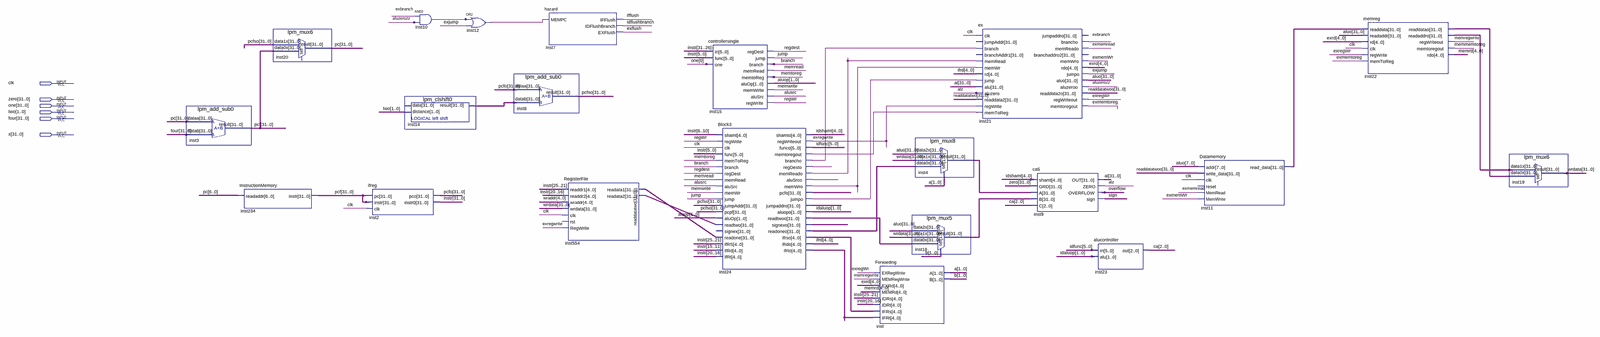
[diagram p0: schematic sheet, whole]
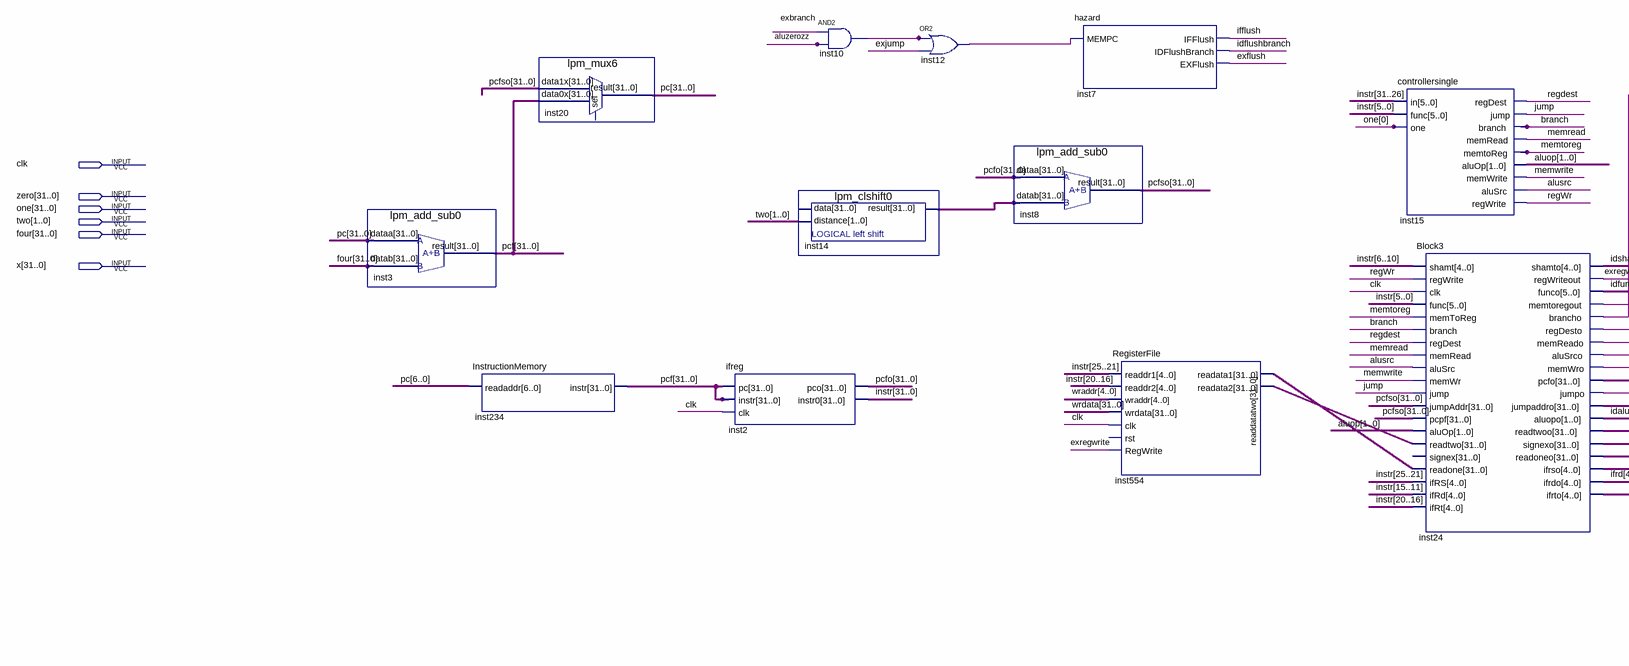
[diagram p1: schematic sheet, left part]
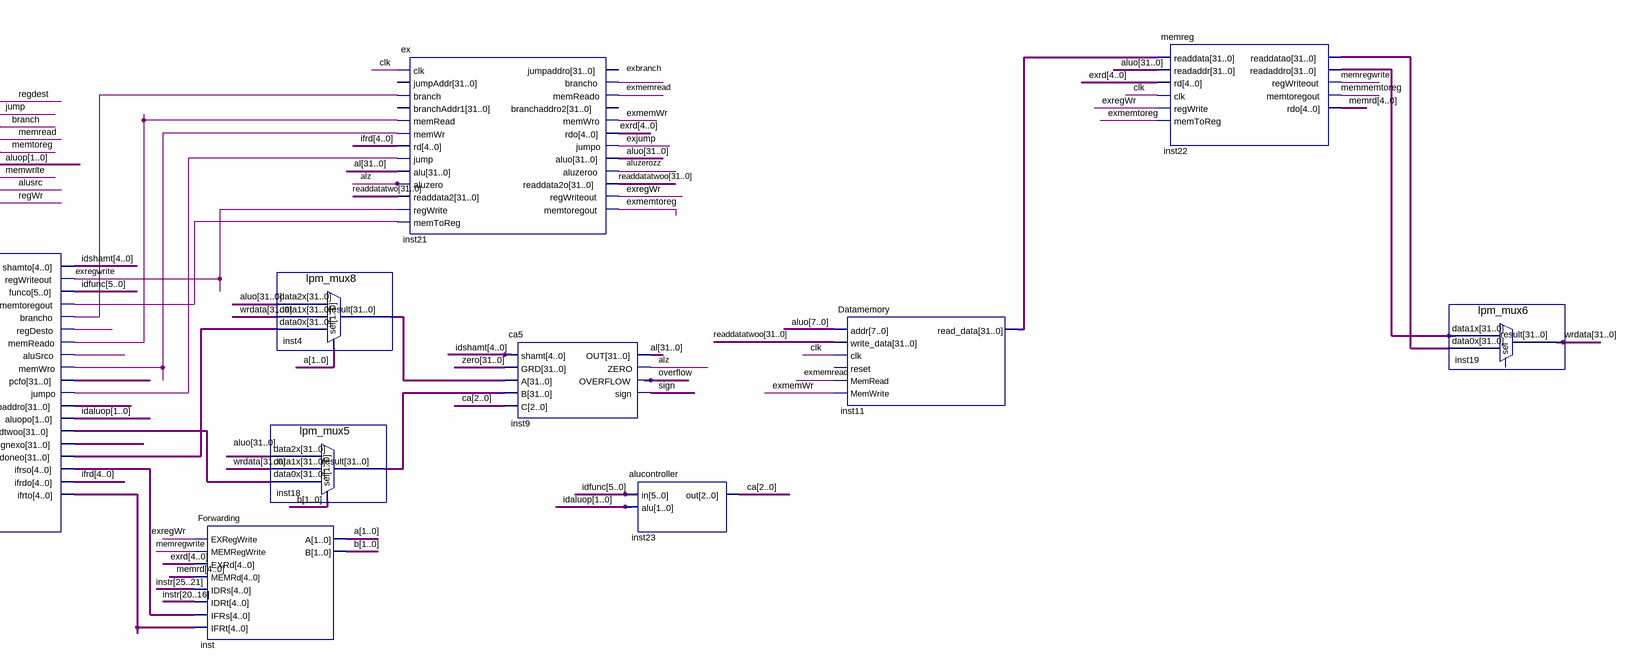
[diagram p2: schematic sheet, right part]
// Quartus schematic pipeline.bdf as structural Verilog: 21 symbols, 6 pins
module pipeline (
  input  clk,
  input  [31:0] zero,
  input  [31:0] one,
  input  [1:0] two,
  input  [31:0] four,
  input  [31:0] x
);

  wire alusrc, aluzerozz, alz, branch, exbranch, exflush, exjump, exmemread, exmemtoreg, exmemWr, exregWr,
       exregwrite, idflushbranch, ifflush, inst10_out, inst12_out, inst24_alusrco, inst24_brancho,
       inst24_jumpo, inst24_memreado, inst24_memtoregout, inst24_memwro, inst24_regdesto, jump, memmemtoreg,
       memread, memregwrite, memtoreg, memwrite, overflow, regdest, regWr, sign;
  wire [1:0] a, aluop, b, idaluop;
  wire [2:0] ca;
  wire [4:0] exrd, idshamt, ifrd, inst24_ifrso, inst24_ifrto, memrd, wraddr;
  wire [5:0] idfunc;
  wire [31:0] al, aluo, inst4_result, inst11_read_data, inst14_result, inst18_result, inst22_readaddro,
       inst22_readdatao, inst24_jumpaddro, inst24_pcfo, inst24_readoneo, inst24_readtwoo, inst24_signexo,
       inst554_readata1, instr, pc, pcf, pcfo, pcfso, readdatatwo, readdatatwoo, wrdata;

  lpm_add_sub0 inst3 (.dataa(pc), .datab(four), .result(pcf));
  InstructionMemory inst234 (.readaddr(pc[6:0]), .instr(pcf));
  lpm_mux6 inst20 (.data1x(pcfso), .data0x(pcf), .result(pc));  // open: sel
  ifreg inst2 (.pc(pcf), .instr(pcf), .clk(clk), .pco(pcfo), .instr0(instr));
  and inst10 (inst10_out, exbranch, aluzerozz);
  lpm_clshift0 inst14 (.distance(two), .result(inst14_result));  // open: data
  or inst12 (inst12_out, inst10_out, exjump);
  lpm_add_sub0 inst8 (.dataa(pcfo), .datab(inst14_result), .result(pcfso));
  hazard inst7 (.MEMPC(inst12_out), .IFFlush(ifflush), .IDFlushBranch(idflushbranch), .EXFlush(exflush));
  RegisterFile inst554 (
    .readdr1(instr[25:21]), .readdr2(instr[20:16]), .wraddr(wraddr), .wrdata(wrdata), .clk(clk),
    .RegWrite(exregwrite), .readata1(inst554_readata1), .readata2(readdatatwo));  // open: rst
  controllersingle inst15 (
    .in(instr[31:26]), .func(instr[5:0]), .one(one[0]), .regDest(regdest), .jump(jump), .branch(branch),
    .memRead(memread), .memtoReg(memtoreg), .aluOp(aluop), .memWrite(memwrite), .aluSrc(alusrc),
    .regWrite(regWr));
  Block3 inst24 (
    .shamt({instr[6], instr[7], instr[8], instr[9], instr[10]}), .regWrite(regWr), .clk(clk),
    .func(instr[5:0]), .memToReg(memtoreg), .branch(branch), .regDest(regdest), .memRead(memread),
    .aluSrc(alusrc), .memWr(memwrite), .jump(jump), .jumpAddr(pcfso), .pcpf(pcfso), .aluOp(aluop),
    .readtwo(readdatatwo), .readone(inst554_readata1), .ifRS(instr[25:21]), .ifRd(instr[15:11]),
    .ifRt(instr[20:16]), .shamto(idshamt), .regWriteout(exregwrite), .funco(idfunc),
    .memtoregout(inst24_memtoregout), .brancho(inst24_brancho), .regDesto(inst24_regdesto),
    .memReado(inst24_memreado), .aluSrco(inst24_alusrco), .memWro(inst24_memwro), .pcfo(inst24_pcfo),
    .jumpo(inst24_jumpo), .jumpaddro(inst24_jumpaddro), .aluopo(idaluop), .readtwoo(inst24_readtwoo),
    .signexo(inst24_signexo), .readoneo(inst24_readoneo), .ifrso(inst24_ifrso), .ifrdo(ifrd),
    .ifrto(inst24_ifrto));  // open: signex
  Forwarding inst (
    .EXRegWrite(exregWr), .MEMRegWrite(memregwrite), .EXRd(exrd), .MEMRd(memrd), .IDRs(instr[25:21]),
    .IDRt(instr[20:16]), .IFRs(inst24_ifrso), .IFRt(inst24_ifrto), .A(a), .B(b));
  lpm_mux5 inst18 (.data2x(aluo), .data1x(wrdata), .data0x(inst24_readtwoo), .sel(b), .result(inst18_result));
  lpm_mux8 inst4 (.data2x(aluo), .data1x(wrdata), .data0x(inst24_readoneo), .sel(a), .result(inst4_result));
  ex inst21 (
    .clk(clk), .branch(inst24_brancho), .memRead(inst24_memreado), .memWr(inst24_memwro), .rd(ifrd),
    .jump(inst24_jumpo), .alu(al), .aluzero(alz), .readdata2(readdatatwo), .regWrite(exregwrite),
    .memToReg(inst24_memtoregout), .brancho(exbranch), .memReado(exmemread), .memWro(exmemWr), .rdo(exrd),
    .jumpo(exjump), .aluo(aluo), .aluzeroo(aluzerozz), .readdata2o(readdatatwoo), .regWriteout(exregWr),
    .memtoregout(exmemtoreg));  // open: jumpAddr, branchAddr1, jumpaddro, branchaddro2
  ca5 inst9 (
    .shamt(idshamt), .GRD(zero), .A(inst4_result), .B(inst18_result), .C(ca), .OUT(al), .ZERO(alz),
    .OVERFLOW(overflow), .sign(sign));
  alucontroller inst23 (.in(idfunc), .alu(idaluop), .out(ca));
  Datamemory inst11 (
    .addr(aluo[7:0]), .write_data(readdatatwoo), .clk(clk), .MemRead(exmemread), .MemWrite(exmemWr),
    .read_data(inst11_read_data));  // open: reset
  memreg inst22 (
    .readdata(inst11_read_data), .readaddr(aluo), .rd(exrd), .clk(clk), .regWrite(exregWr),
    .memToReg(exmemtoreg), .readdatao(inst22_readdatao), .readaddro(inst22_readaddro),
    .regWriteout(memregwrite), .memtoregout(memmemtoreg), .rdo(memrd));
  lpm_mux6 inst19 (.data1x(inst22_readaddro), .data0x(inst22_readdatao), .result(wrdata));  // open: sel
endmodule
